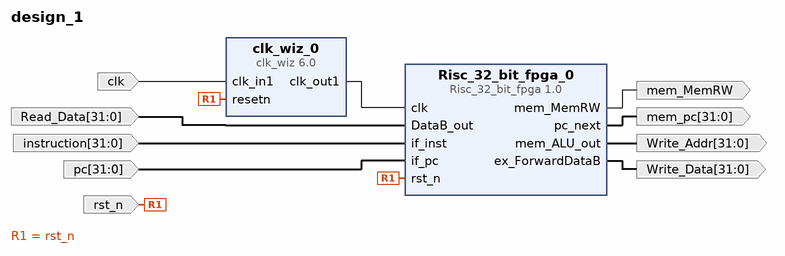
[diagram p0: block diagram of the top level]
# Vivado block design design_1, xc7z020clg484-1, Vivado 2018.1
create_bd_design design_1

create_bd_port -dir I -type rst rst_n
set_property -dict {CONFIG.POLARITY ACTIVE_LOW} [get_bd_ports rst_n]
create_bd_port -dir I -type clk clk
set_property -dict {CONFIG.FREQ_HZ 500000000 CONFIG.PHASE 0.000} [get_bd_ports clk]
create_bd_port -dir I -from 31 -to 0 Read_Data
create_bd_port -dir I -from 31 -to 0 instruction
create_bd_port -dir I -from 31 -to 0 pc
create_bd_port -dir O -from 31 -to 0 Write_Addr
create_bd_port -dir O -from 31 -to 0 Write_Data
create_bd_port -dir O mem_MemRW
create_bd_port -dir O -from 31 -to 0 mem_pc

create_bd_cell -type ip -vlnv xilinx.com:ip:clk_wiz:6.0 clk_wiz_0
set_property -dict [list \
  CONFIG.RESET_PORT resetn \
  CONFIG.RESET_TYPE ACTIVE_LOW \
  CONFIG.USE_BOARD_FLOW true \
  CONFIG.CLK_IN1_BOARD_INTERFACE sys_clock \
] [get_bd_cells clk_wiz_0]
create_bd_cell -type ip -vlnv user.org:user:Risc_32_bit_fpga:1.0 Risc_32_bit_fpga_0

# ---- connections ----

connect_bd_net -net sys_clock_1 [get_bd_ports clk] [get_bd_pins clk_wiz_0/clk_in1]
connect_bd_net [get_bd_pins clk_wiz_0/clk_out1] [get_bd_pins Risc_32_bit_fpga_0/clk]
connect_bd_net -net DataB_out_1 [get_bd_ports Read_Data] [get_bd_pins Risc_32_bit_fpga_0/DataB_out]
connect_bd_net -net if_inst_1 [get_bd_ports instruction] [get_bd_pins Risc_32_bit_fpga_0/if_inst]
connect_bd_net -net if_pc_1 [get_bd_ports pc] [get_bd_pins Risc_32_bit_fpga_0/if_pc]
connect_bd_net [get_bd_pins Risc_32_bit_fpga_0/mem_ALU_out] [get_bd_ports Write_Addr]
connect_bd_net [get_bd_pins Risc_32_bit_fpga_0/ex_ForwardDataB] [get_bd_ports Write_Data]
connect_bd_net [get_bd_pins Risc_32_bit_fpga_0/mem_MemRW] [get_bd_ports mem_MemRW]
connect_bd_net [get_bd_pins Risc_32_bit_fpga_0/pc_next] [get_bd_ports mem_pc]
connect_bd_net -net reset_rtl_1 [get_bd_ports rst_n] [get_bd_pins clk_wiz_0/resetn] [get_bd_pins Risc_32_bit_fpga_0/rst_n]

validate_bd_design
save_bd_design
